# Altium schematic sheet CLK_SYNTH.SchDoc: My title
size A3; Organization: University of California; Address1: 475 Portola Plaza; Address2: Los Angeles, CA 90095; DocumentNumber: 14; Revision: R01; SheetNumber: 14; SheetTotal: 35
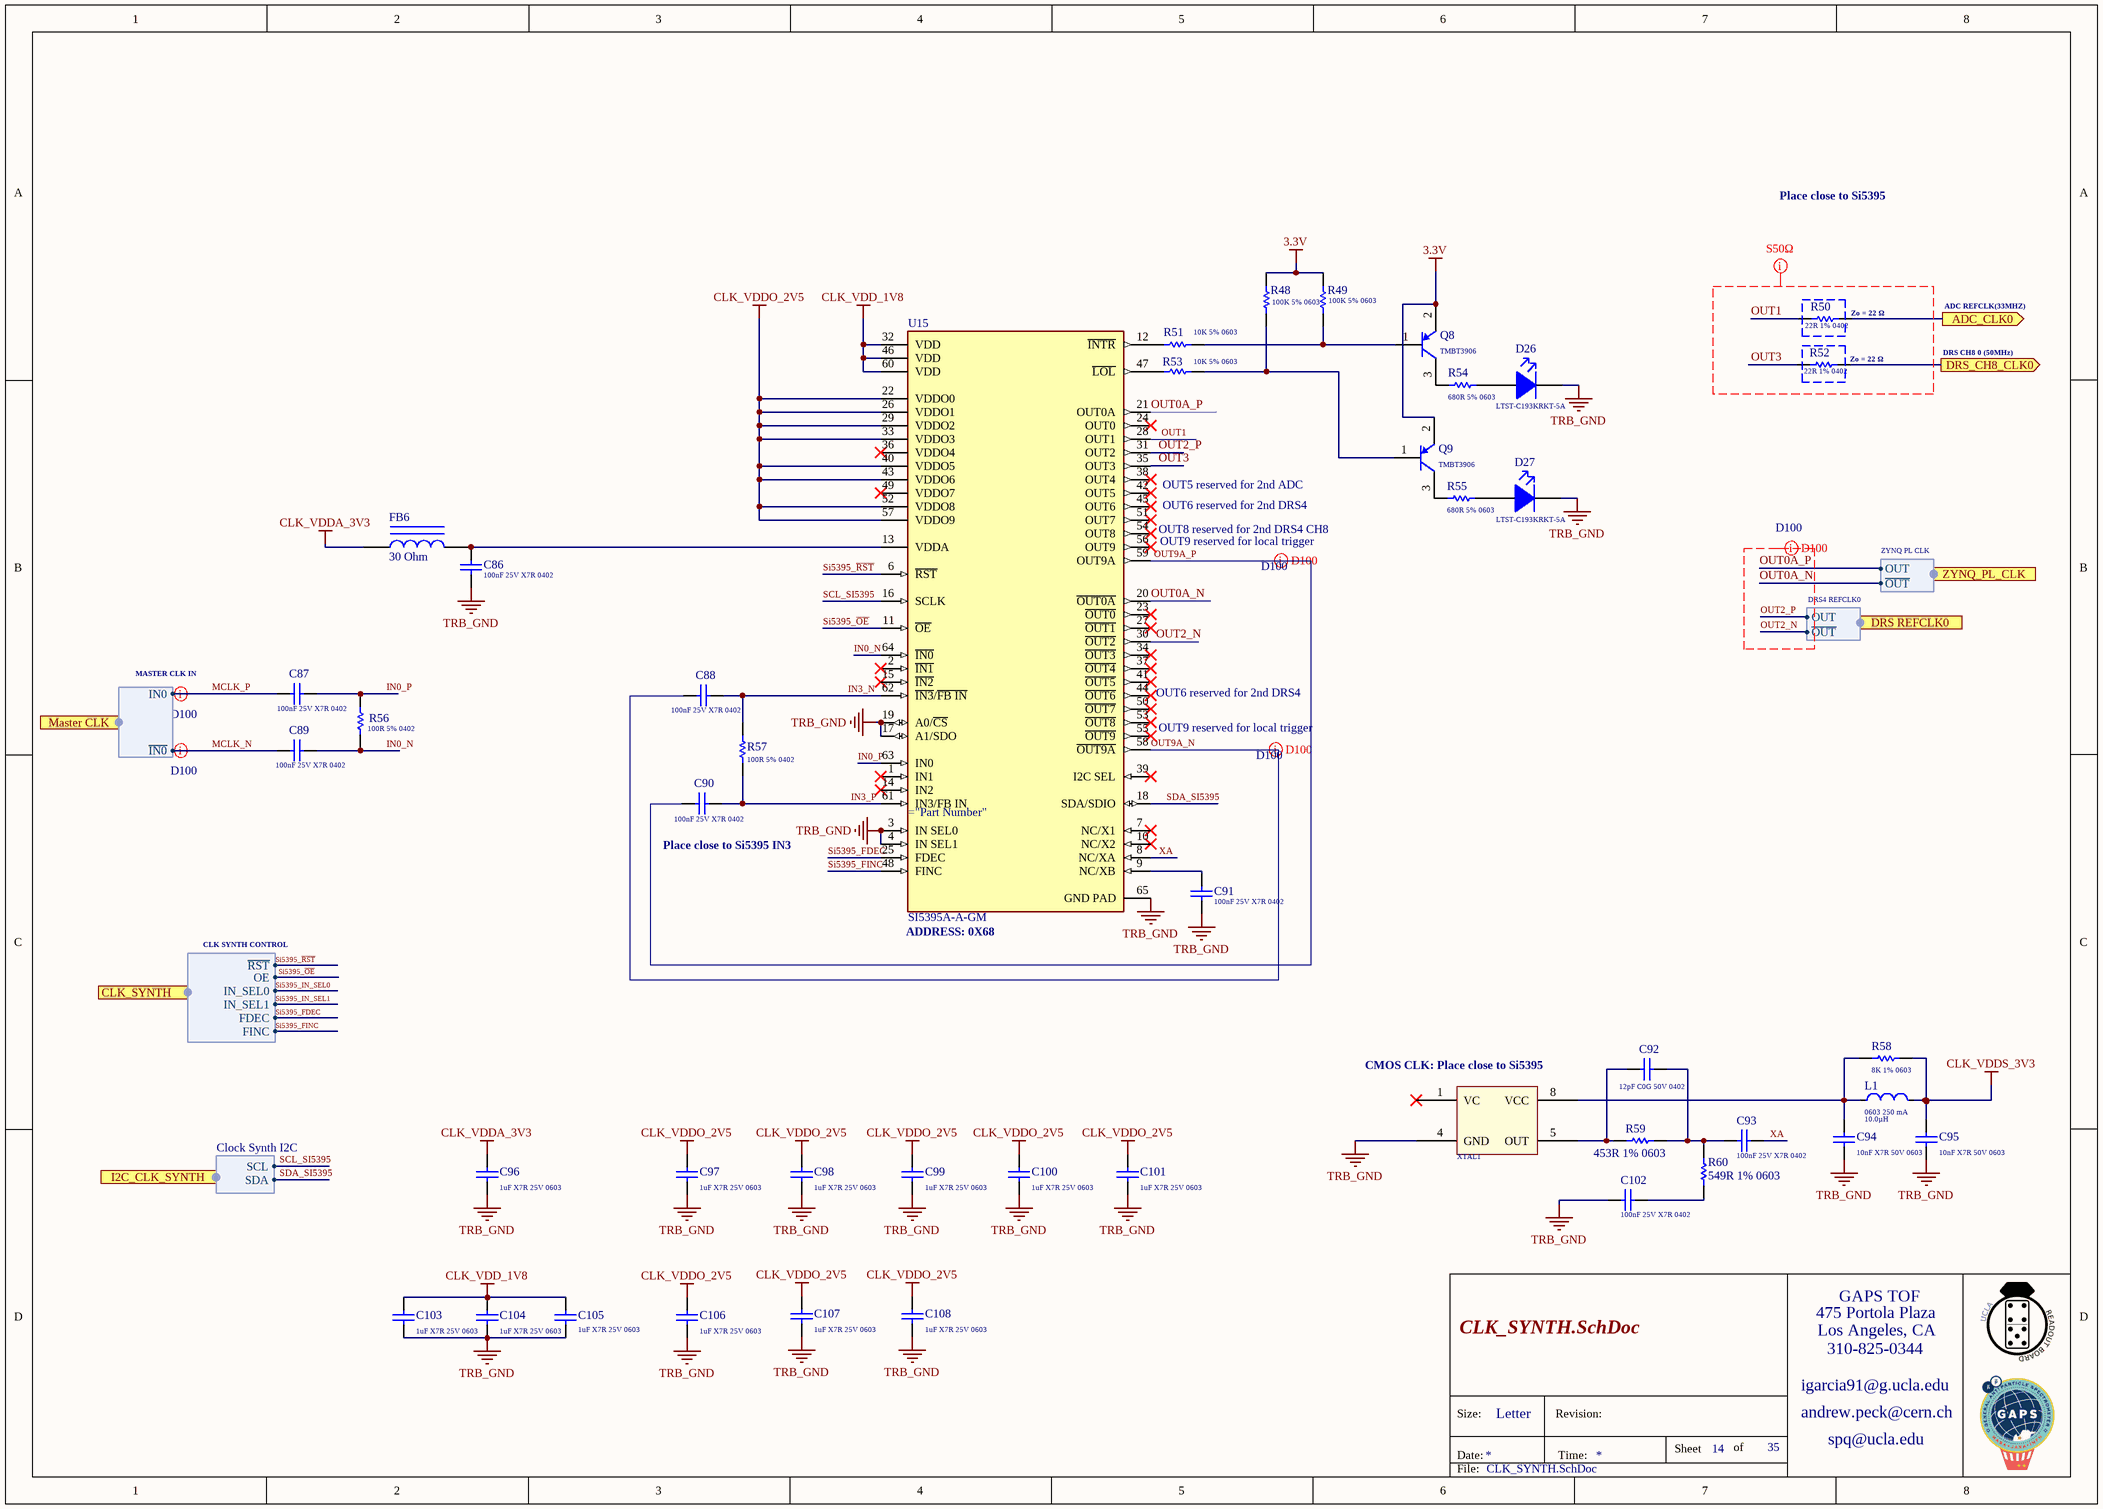
[diagram p0: CLK_SYNTH.SchDoc]

## Parts
C86  Capacitance: 100nF 25V X7R 0402  [Cap_Taiyo_Yuden_TMK105B7104KV-FR_100nF]  (hidden comment: Cap_Taiyo_Yuden_TMK105B7104KV-FR_100nF)
C87  Capacitance: 100nF 25V X7R 0402  [Cap_Taiyo_Yuden_TMK105B7104KV-FR_100nF]  (hidden comment: Cap_Taiyo_Yuden_TMK105B7104KV-FR_100nF)
C88  Capacitance: 100nF 25V X7R 0402  [Cap_Taiyo_Yuden_TMK105B7104KV-FR_100nF]  (hidden comment: Cap_Taiyo_Yuden_TMK105B7104KV-FR_100nF)
C89  Capacitance: 100nF 25V X7R 0402  [Cap_Taiyo_Yuden_TMK105B7104KV-FR_100nF]  (hidden comment: Cap_Taiyo_Yuden_TMK105B7104KV-FR_100nF)
C90  Capacitance: 100nF 25V X7R 0402  [Cap_Taiyo_Yuden_TMK105B7104KV-FR_100nF]  (hidden comment: Cap_Taiyo_Yuden_TMK105B7104KV-FR_100nF)
C91  Capacitance: 100nF 25V X7R 0402  [Cap_Taiyo_Yuden_TMK105B7104KV-FR_100nF]  (hidden comment: Cap_Taiyo_Yuden_TMK105B7104KV-FR_100nF)
C92  Capacitance: 12pF C0G 50V 0402  [Cap_Murata_GCQ1555C1H120FB01D_12pF]  (hidden comment: Cap_Murata_GCQ1555C1H120FB01D_12pF)
C93  Capacitance: 100nF 25V X7R 0402  [Cap_Taiyo_Yuden_TMK105B7104KV-FR_100nF]  (hidden comment: Cap_Taiyo_Yuden_TMK105B7104KV-FR_100nF)
C94  Capacitance: 10nF X7R 50V 0603  [Kemet_C0603_0]  (hidden comment: Cap_Kemet_C0603C103J5RACTU_eec)
C95  Capacitance: 10nF X7R 50V 0603  [Kemet_C0603_0]  (hidden comment: Cap_Kemet_C0603C103J5RACTU_eec)
C96  Capacitance: 1uF X7R 25V 0603  [Cap_Murata_GCJ188R71E105KA01J_1uF]  (hidden comment: Cap_Murata_GCJ188R71E105KA01J_1uF)
C97  Capacitance: 1uF X7R 25V 0603  [Cap_Murata_GCJ188R71E105KA01J_1uF]  (hidden comment: Cap_Murata_GCJ188R71E105KA01J_1uF)
C98  Capacitance: 1uF X7R 25V 0603  [Cap_Murata_GCJ188R71E105KA01J_1uF]  (hidden comment: Cap_Murata_GCJ188R71E105KA01J_1uF)
C99  Capacitance: 1uF X7R 25V 0603  [Cap_Murata_GCJ188R71E105KA01J_1uF]  (hidden comment: Cap_Murata_GCJ188R71E105KA01J_1uF)
C100  Capacitance: 1uF X7R 25V 0603  [Cap_Murata_GCJ188R71E105KA01J_1uF]  (hidden comment: Cap_Murata_GCJ188R71E105KA01J_1uF)
C101  Capacitance: 1uF X7R 25V 0603  [Cap_Murata_GCJ188R71E105KA01J_1uF]  (hidden comment: Cap_Murata_GCJ188R71E105KA01J_1uF)
C102  Capacitance: 100nF 25V X7R 0402  [Cap_Taiyo_Yuden_TMK105B7104KV-FR_100nF]  (hidden comment: Cap_Taiyo_Yuden_TMK105B7104KV-FR_100nF)
C103  Capacitance: 1uF X7R 25V 0603  [Cap_Murata_GCJ188R71E105KA01J_1uF]  (hidden comment: Cap_Murata_GCJ188R71E105KA01J_1uF)
C104  Capacitance: 1uF X7R 25V 0603  [Cap_Murata_GCJ188R71E105KA01J_1uF]  (hidden comment: Cap_Murata_GCJ188R71E105KA01J_1uF)
C105  Capacitance: 1uF X7R 25V 0603  [Cap_Murata_GCJ188R71E105KA01J_1uF]  (hidden comment: Cap_Murata_GCJ188R71E105KA01J_1uF)
C106  Capacitance: 1uF X7R 25V 0603  [Cap_Murata_GCJ188R71E105KA01J_1uF]  (hidden comment: Cap_Murata_GCJ188R71E105KA01J_1uF)
C107  Capacitance: 1uF X7R 25V 0603  [Cap_Murata_GCJ188R71E105KA01J_1uF]  (hidden comment: Cap_Murata_GCJ188R71E105KA01J_1uF)
C108  Capacitance: 1uF X7R 25V 0603  [Cap_Murata_GCJ188R71E105KA01J_1uF]  (hidden comment: Cap_Murata_GCJ188R71E105KA01J_1uF)
D26  LTST-C193KRKT-5A  [Led_Lite-On_LTST-C193KGKT-5A_Red]
D27  LTST-C193KRKT-5A  [Led_Lite-On_LTST-C193KGKT-5A_Red]
FB6  30 Ohm  [Feb_MURATA_BLM15AX300SZ1D_30]
L1  0603 250 mA  Inductance: 10.0µH  [TDK_MLZ1608M100WT_0]
Q8  Series: TMBT3906  [BJT_PNP_Toshiba_TMBT3906]  (hidden comment: BJT_PNP_Toshiba_TMBT3906)
Q9  Series: TMBT3906  [BJT_PNP_Toshiba_TMBT3906]  (hidden comment: BJT_PNP_Toshiba_TMBT3906)
R48  100K 5% 0603  [RESC0603(1608)_N]
R49  100K 5% 0603  [RESC0603(1608)_N]
R50  22R 1% 0402  [RESC0402(1005)_L]
R51  10K 5% 0603  [RESC0603(1608)_L]
R52  22R 1% 0402  [RESC0402(1005)_L]
R53  10K 5% 0603  [RESC0603(1608)_L]
R54  680R 5% 0603  [RESC0603(1608)_L]
R55  680R 5% 0603  [RESC0603(1608)_L]
R56  100R 5% 0402  [RESC0402(1005)_L]
R57  100R 5% 0402  [RESC0402(1005)_L]
R58  8K 1% 0603  [Res_Yageo_RT0603BRE078KL_8K]
R59  453R 1% 0603  [RESC1608X55X30NL15T15]
R60  549R 1% 0603  [RESC1608X55X30NL15T15]
U15  Series: SI5395A-A-GM  [Si5395]  (hidden comment: IC_Silicon_Laboratories_ SI5395A-A-GM_CLK)
XTAL1  TCXO_Murata_XTCLH50M000CHJA3P0_50MHz  [TCXO_Murata_XTCLH50M000CHJA3P0_50MHz]  (value not drawn)

## Ports
ADC_CLK0 (out), CLK_SYNTH (harness CLK SYNTH CONTROL), DRS REFCLK0 (harness DRS4 REFCLK0), DRS_CH8_CLK0 (out), I2C_CLK_SYNTH (harness Clock Synth I2C), Master CLK (harness MASTER CLK IN), ZYNQ_PL_CLK (harness ZYNQ PL CLK)

## Harnesses
MASTER CLK IN: IN0, ~{IN0}
CLK SYNTH CONTROL: ~{RST}, OE, IN_SEL0, IN_SEL1, FDEC, FINC
DRS4 REFCLK0: OUT, ~{OUT}
ZYNQ PL CLK: OUT, ~{OUT}
Clock Synth I2C: SCL, SDA

## Nets
3.3V: Q8.2(E) Q9.2(E) R48.2 R49.2
CLK_VDD_1V8: C103.2 C104.2 C105.2 U15.32(VDD) U15.46(VDD) U15.60(VDD)
CLK_VDDA_3V3: C96.2 FB6.1
CLK_VDDO_2V5: C97.2 C98.2 C99.2 C100.2 C101.2 C106.2 C107.2 C108.2 U15.22(VDDO0) U15.26(VDDO1) U15.29(VDDO2) U15.33(VDDO3) U15.40(VDDO5) U15.43(VDDO6) U15.52(VDDO8) U15.57(VDDO9)
CLK_VDDS_3V3: C95.1 L1.2 R58.2
TRB_GND: C86.1 C91.1 C94.2 C95.2 C96.1 C97.1 C98.1 C99.1 C100.1 C101.1 C102.1 C103.1 C104.1 C105.1 C106.1 C107.1 C108.1 D26.1(K) D27.1(K) U15.3(IN_SEL0) U15.4(IN_SEL1) U15.17(A1/SDO) U15.19(A0/~{CS}) U15.65(GND_PAD) XTAL1.4(GND)
ADC_CLK0: R50.1 ; port ADC_CLK0
DRS_CH8_CLK0: R52.1 ; port DRS_CH8_CLK0
IN0_N: C89.2 R56.1 U15.64(~{IN0})
IN0_P: C87.2 R56.2 U15.63(IN0)
IN3_N: C88.2 R57.2 U15.62(~{IN3}/~{FB_IN})
IN3_P: C90.2 R57.1 U15.61(IN3/FB_IN)
MCLK_N: C89.1 ; port Master CLK.~{IN0}
MCLK_P: C87.1 ; port Master CLK.IN0
OUT0A_N: U15.20(~{OUT0A}) ; port ZYNQ_PL_CLK.~{OUT}
OUT0A_P: U15.21(OUT0A) ; port ZYNQ_PL_CLK.OUT
OUT1: R50.2 U15.28(OUT1)
OUT2_N: U15.30(~{OUT2}) ; port DRS REFCLK0.~{OUT}
OUT2_P: U15.31(OUT2) ; port DRS REFCLK0.OUT
OUT3: R52.2 U15.35(OUT3)
OUT9A_N: C88.1 U15.58(~{OUT9A})
OUT9A_P: C90.1 U15.59(OUT9A)
SCL_SI5395: U15.16(SCLK) ; port I2C_CLK_SYNTH.SCL
SDA_SI5395: U15.18(SDA/SDIO) ; port I2C_CLK_SYNTH.SDA
Si5395_FDEC: U15.25(FDEC) ; port CLK_SYNTH.FDEC
Si5395_FINC: U15.48(FINC) ; port CLK_SYNTH.FINC
Si5395_IN_SEL0: port CLK_SYNTH.IN_SEL0
Si5395_IN_SEL1: port CLK_SYNTH.IN_SEL1
Si5395_~{OE}: U15.11(~{OE}) ; port CLK_SYNTH.OE
Si5395_~{RST}: U15.6(~{RST}) ; port CLK_SYNTH.~{RST}
XA: C93.2 U15.8(NC/XA)
NetC86_2: C86.2 FB6.2 U15.13(VDDA)
NetC91_2: C91.2 U15.9(NC/XB)
NetC92_1: C92.1 C93.1 R59.2 R60.2
NetC92_2: C92.2 R59.1 XTAL1.5(OUT)
NetC94_1: C94.1 L1.1 R58.1 XTAL1.8(VCC)
NetC102_2: C102.2 R60.1
NetD26_2: D26.2(A) R54.2
NetD27_2: D27.2(A) R55.2
NetQ8_1: Q8.1(B) R49.1 R51.1
NetQ8_3: Q8.3(C) R54.1
NetQ9_1: Q9.1(B) R48.1 R53.1
NetQ9_3: Q9.3(C) R55.1
NetR51_2: R51.2 U15.12(~{INTR})
NetR53_2: R53.2 U15.47(~{LOL})

Not connected (* = marked no-connect by the designer): U15 1(IN1)* 2(~{IN1})* 7(NC/X1)* 10(NC/X2)* 14(IN2)* 15(~{IN2})* 23(~{OUT0})* 24(OUT0)* 27(~{OUT1})* 34(~{OUT3})* 36(VDDO4)* 37(~{OUT4})* 38(OUT4)* 39(I2C_SEL)* 41(~{OUT5})* 42(OUT5)* 44(~{OUT6})* 45(OUT6)* 49(VDDO7)* 50(~{OUT7})* 51(OUT7)* 53(~{OUT8})* 54(OUT8)* 55(~{OUT9})* 56(OUT9)*; XTAL1 1(VC)*

## Layout directives
differential pair; differential pair class D100: OUT0A_N, OUT0A_P, OUT2_N, OUT2_P, OUT9A_N, OUT9A_P
net class S50: OUT1, OUT3
differential pair; differential pair class D100; rule Matched Net Lengths [Tolerance = 100mil]: MCLK_N, MCLK_P

## Notes on the sheet
- Place close to Si5395
- (near R50) Zo = 22 Ω
- ADC REFCLK(33MHZ)
- (near R52) Zo = 22 Ω
- DRS CH8 0 (50MHz)
- (near U15) OUT5 reserved for 2nd ADC
- (near U15) OUT6 reserved for 2nd DRS4
- (near U15) OUT8 reserved for 2nd DRS4 CH8
- (near U15) OUT9 reserved for local trigger
- (near C90) Place close to Si5395 IN3
- (near U15) ADDRESS: 0X68
- (near XTAL1) CMOS CLK: Place close to Si5395
- 475 Portola Plaza
- GAPS TOF
- igarcia91@g.ucla.edu
- Los Angeles, CA
- 310-825-0344
- Size:
- Date:
- Letter
- Revision:
- Time:
- Sheet
- of
- andrew.peck@cern.ch
- spq@ucla.edu
- File:

## Library data of the parts
C86-C91 C93 C102 = Cap_Taiyo_Yuden_TMK105B7104KV-FR_100nF: CAP CER 100nF 25V X7R 0402; Supplier 1: Mouser; Supplier Part Number 1: 963-TMK105B7104KV-FR
C92 = Cap_Murata_GCQ1555C1H120FB01D_12pF: MLCC - SMD/SMT 0402 50VDC 12pF 1% AEC-Q200; Manufacturer 1: Murata; Supplier 1: Mouser; Supplier Part Number 1: 81-GCQ1555C1H120FB1D; Manufacturer Part Number 1: GCQ1555C1H120FB01D
C94 C95 = Cap_Kemet_C0603C103J5RACTU_eec: CAP CER 10nF 50V X7R 0603; Manufacturer: Kemet; Mfg Package Ident: C0603; Part Number: C0603C103J5RACTU; helpURL: https://upverter.com/upn/revision/8a8d0c297e33ac74/; ComponentLink2Description: Datasheet; Temperature: -55°C to +125°C; Package: C0603; Supplier 2: Mouser; Price: 0.0184203126773; Supplier 1: Digi-Key; ComponentLink1URL: https://upverter.com/upn/revision/8a8d0c297e33ac74/; Supplier Part Number 2: 80-C0603C103J5R; Supplier Part Number 1: 399-1092-1-ND; Value: 10nF; ComponentLink1Description: Upverter; ComponentLink2URL: https://content.kemet.com/datasheets/KEM_C1002_X7R_SMD.pdf; RoHS: TRUE; Mouser Part Number: 80-C0603C103J5R; Temperature Range High: +125°C; Digikey Description: CAP CER 10000PF 50V X7R 0603; Digikey Part Number: 399-1092-1-ND; Lead Free: yes; Temperature Range Low: -55°C; Voltage: 50V
C96-C101 C103-C108 = Cap_Murata_GCJ188R71E105KA01J_1uF: CAP CER 1uF 25V X7R 0603; Supplier 1: Mouser; Supplier Part Number 1: 81-GCJ188R71E105KA1J
D26 D27 = Led_Lite-On_LTST-C193KGKT-5A_Red: Standard LEDs - SMD Red 470nm 28mcd 20mA; Supplier 1: Mouser; Supplier Part Number 1: 859-LTSTC193KRKT5A; Series: LTST-C193KRKT-5A
FB6 = Feb_MURATA_BLM15AX300SZ1D_30: Feb SMD 30 OHM 25% 3/4W 0402; Supplier 1: Mouser; Supplier Part Number 1: 81-BLM15AX300SZ1D
L1 = Ind_TDK_MLZ1608M100WT_eec: IND 10µH Shielded Multilayer Inductor 250mA 1.365 Ohm Max 0603 (1608 Metric); Manufacturer: TDK; Value: 10.0µH; Tolerance: ±20%; Part Number: MLZ1608M100WT; helpURL: https://upverter.com/upn/revision/22fa022ced0eb0ec/; ComponentLink2Description: Datasheet; Temperature: -55°C to +125°C; Package: 0603 (1608 metric); Supplier 2: Mouser; Supplier 1: Digi-Key; ComponentLink1URL: https://upverter.com/upn/revision/22fa022ced0eb0ec/; Supplier Part Number 2: 810-MLZ1608M100WT000; Supplier Part Number 1: 445-6389-1-ND; ComponentLink1Description: Upverter; ComponentLink2URL: https://product.tdk.com/info/en/catalog/datasheets/inductor_commercial_decoupling_mlz1608_en.pdf; RoHS: TRUE; Mouser Part Number: 810-MLZ1608M100WT000; Current Rating: 250mA; Ipc Land Pattern Name: CAPC16080X45; Temperature Range High: +125°C; Digikey Description: IND 10µH Shielded Multilayer Inductor 250mA 1.365 Ohm Max 0603 (1608 Metric); Digikey Part Number: 445-6389-1-ND; Lead Free: yes; Temperature Range Low: -55°C; DC Resistance (DCR): 1.365 Ohm Max
Q8 Q9 = BJT_PNP_Toshiba_TMBT3906: Bipolar Transistors - BJT Transistor for Low Freq. Amplification; Manufacturer Part Number 1: TMBT3906,LM; Supplier Part Number 1: 757-TMBT3906LM; Supplier 1: Mouser; Manufacturer: Toshiba
R48 R49 = CMP-1012-00122-1: 100K 0.1W 5% 0603 (1608 Metric)  SMD; Case-EIA: 0603; Value: 100000.00 Ohm; Case-Metric: 1608; Tolerance: 5 %; Power: 0.1 W; Technology: SMT
R50 R52 = CMP-1011-00320-1: 22R 0.063W 1% 0402 (1005 Metric)  SMD; Case-EIA: 0402; Case-Metric: 1005; Value: 22.00 Ohm; Tolerance: 1 %; Technology: SMT; Power: 0.063 W
R51 R53 = CMP-1012-00098-1: 10K 0.1W 5% 0603 (1608 Metric)  SMD; Case-EIA: 0603; Value: 10000.00 Ohm; Case-Metric: 1608; Technology: SMT; Tolerance: 5 %; Power: 0.1 W
R54 R55 = CMP-1012-00070-1: 680R 0.1W 5% 0603 (1608 Metric)  SMD; Case-EIA: 0603; Value: 680.00 Ohm; Case-Metric: 1608; Tolerance: 5 %; Technology: SMT; Power: 0.1 W
R56 R57 = CMP-1011-00050-1: 100R 0.063W 5% 0402 (1005 Metric)  SMD; Case-EIA: 0402; Value: 100.00 Ohm; Case-Metric: 1005; Tolerance: 5 %; Technology: SMT; Power: 0.063 W
R58 = Res_Yageo_RT0603BRE078KL_8K: 8K 0.1W 1% 0603 (1608 Metric)  SMD; Supplier 1: Mouser; Supplier Part Number 1: 603-RT0603BRE078KL
R59 = CMP-2000-00511-1: ERJ-3EKF4530V; Manufacturer: Panasonic; Part Number: ERJ-3EKF4530V
R60 = CMP-2000-00559-1: ERJ-3EKF5490V; Manufacturer: Panasonic; Part Number: ERJ-3EKF5490V
U15 = IC_Silicon_Laboratories_ SI5395A-A-GM_CLK: Clock Synthesizer / Jitter Cleaner Single PLL jitter attenuator with xtal: 12-outputs up to 1028 MHz; integer+fractional; Supplier 1: Mouser; Supplier Part Number 1: 634-SI5395A-A-GM
XTAL1 = TCXO_Murata_XTCLH50M000CHJA3P0_50MHz: TCXO Oscillators 50MHz 5x3.2x1.5mm 0.2ppm max Crystal; Supplier 1: Mouser; Supplier Part Number 1: 81-XTCLH50M000CHJA3P; Supplier 2: Digi-Key; Supplier Part Number 2: 490-18042-1-ND